# Altium schematic sheet PowerManagement.SchDoc: Power Management
size A3; DrawnBy: Fabian Niederberger; Organization: HSLU T&A; Address1: Abteilung Elektrotechnik; Address2: Technikumsstrasse 21; Address3: CH-6048 Horw; DocumentNumber: 1; Revision: 1.0; SheetNumber: 1; SheetTotal: 1; Projektname: PREN2 Team10; pcbDesigner: Fabian Niederberger; DocumentName: Power Managment; ProjectName: Power Managment
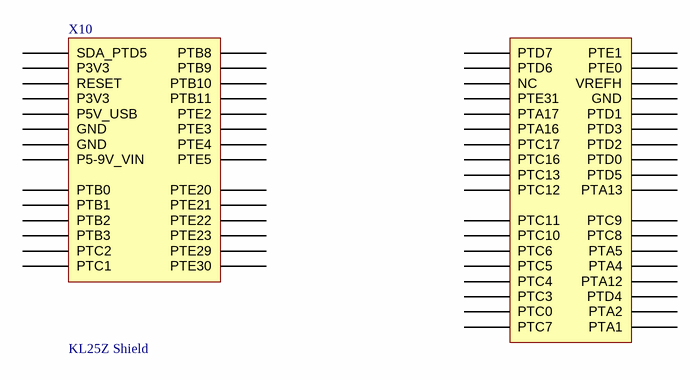
[diagram p0: PowerManagement.SchDoc]

## Parts
X10  KL25Z Shield  [Freedom KL25Z Headerarray]

## Nets

Not connected (* = marked no-connect by the designer): X10 1(SDA_PTD5) 2(PTB8) 3(P3V3) 4(PTB9) 5(RESET) 6(PTB10) 7(P3V3) 8(PTB11) 9(P5V_USB) 10(PTE2) 11(GND) 12(PTE3) 13(GND) 14(PTE4) 15(P5-9V_VIN) 16(PTE5) 17(PTB0) 18(PTE20) 19(PTB1) 20(PTE21) 21(PTB2) 22(PTE22) 23(PTB3) 24(PTE23) 25(PTC2) 26(PTE29) 27(PTC1) 28(PTE30) 29(PTD7) 30(PTE1) 31(PTD6) 32(PTE0) 33(NC) 34(VREFH) 35(PTE31) 36(GND) 37(PTA17) 38(PTD1) 39(PTA16) 40(PTD3) 41(PTC17) 42(PTD2) 43(PTC16) 44(PTD0) 45(PTC13) 46(PTD5) 47(PTC12) 48(PTA13) 49(PTC11) 50(PTC9) 51(PTC10) 52(PTC8) 53(PTC6) 54(PTA5) 55(PTC5) 56(PTA4) 57(PTC4) 58(PTA12) 59(PTC3) 60(PTD4) 61(PTC0) 62(PTA2) 63(PTC7) 64(PTA1)

## Notes on the sheet
- Project:
- Drawn by:
- Size:
- Sheet
- A3
- Rev.:
- of
- Date:
- File:

## Library data of the parts
X10 = Freedom KL25Z Header: FRDM KL25Z Shield